# Altium schematic sheet 220VAC_to_24VDC_Circuit.SchDoc
size 254 x 330 mm; SheetNumber: 1; SheetTotal: 3
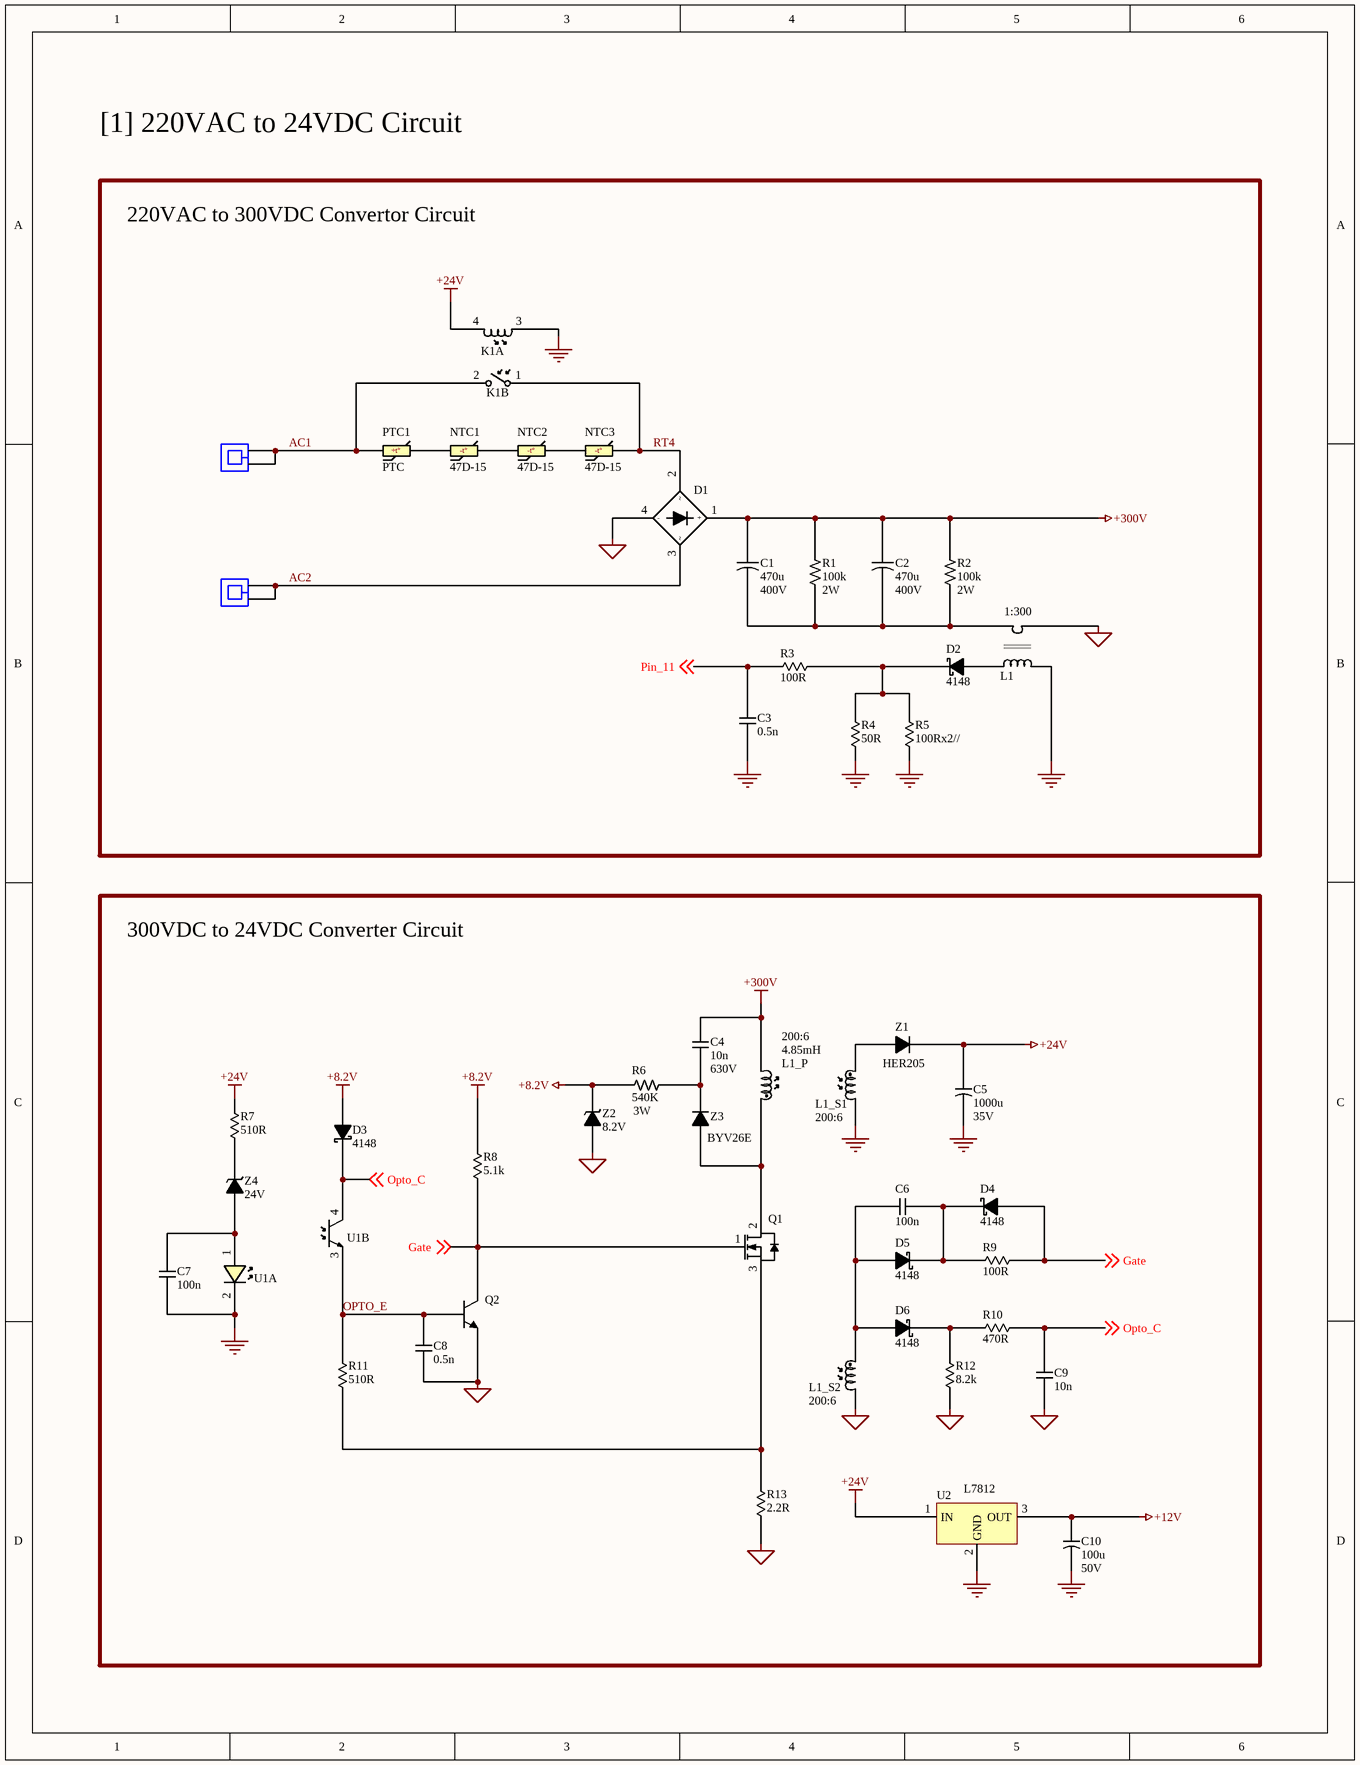
[diagram p0: 220VAC_to_24VDC_Circuit.SchDoc]

## Parts
C1  470u  Voltage: 400V  [Cap_THD_Polarized_10mm]
C2  470u  Voltage: 400V  [Cap_THD_Polarized_10mm]
C3  0.5n  [Cap_THD_Ceramic_5mm]
C4  10n  Voltage: 630V  [Cap_THD_Film_10mm]
C5  1000u  Voltage: 35V  [Cap_THD_Polarized_5mm]
C6  100n  [Cap_THD_Ceramic_5mm]
C7  100n  [Cap_THD_Ceramic_5mm]
C8  0.5n  [Cap_THD_Ceramic_5mm]
C9  10n  [Cap_THD_Ceramic_5mm]
C10  100u  Voltage: 50V  [Cap_THD_Polarized_5mm]
D1  D  [Bridge_THD]  (value not drawn)
D2  4148  [Diode_THD_7.1mm]
D3  4148  [Diode_THD_7.1mm]
D4  4148  [Diode_THD_7.1mm]
D5  4148  [Diode_THD_7.1mm]
D6  4148  [Diode_THD_7.1mm]
J1  63824-1  [CONN_QC_Faston_5mm]  (value not drawn)
J2  63824-1  [CONN_QC_Faston_5mm]  (value not drawn)
K1  K  [Relay_10mm]  (value not drawn)  (parts A,B of 2)
L1  L  [Current_Transformer]  (value not drawn)
L1_P  4.85mH  [Inductor_THD_5mm]
L1_S1  L  [Inductor_THD_5mm]  (value not drawn)
L1_S2  L  [Inductor_THD_5mm]  (value not drawn)
NTC1  47D-15  [NTC_THD_7.5mm]
NTC2  47D-15  [NTC_THD_7.5mm]
NTC3  47D-15  [NTC_THD_7.5mm]
PTC1  PTC  [PTC_THD_5mm]
Q1  K3878  [TO247]  (value not drawn)
Q2  SS8050  [TO92]  (value not drawn)
R1  100k  Power: 2W  [Res_THD_2W_17.6mm]
R2  100k  Power: 2W  [Res_THD_2W_17.6mm]
R3  100R  [Res_THD_0.25W_10mm]
R4  50R  [Res_THD_0.25W_10mm]
R5  100Rx2//  [Res_THD_0.25W_10mm]
R6  540K  Power: 3W  [Res_THD_2W_17.6mm]
R7  510R  [Res_THD_0.25W_10mm]
R8  5.1k  [Res_THD_0.25W_10mm]
R9  100R  [Res_THD_0.25W_10mm]
R10  470R  [Res_THD_0.25W_10mm]
R11  510R  [Res_THD_0.25W_10mm]
R12  8.2k  [Res_THD_0.25W_10mm]
R13  2.2R  [Res_THD_0.25W_10mm]
U1  U  [DIP4]  (value not drawn)  (parts A,B of 2)
U2  L7812  [TO220_3]
Z1  HER205  [Diode_THD_10.8mm]
Z2  8.2V  [Diode_THD_7.1mm]
Z3  BYV26E  [Diode_THD_10.8mm]
Z4  24V  [Diode_THD_7.1mm]

## Blocks framed on the sheet
220VAC to 300VDC Convertor Circuit: C1-C3 D1 D2 J1 J2 K1 L1 NTC1-NTC3 PTC1 R1-R5
300VDC to 24VDC Converter Circuit: C4-C10 D3-D6 L1_P L1_S1 L1_S2 Q1 Q2 R6-R13 U1 U2 Z1-Z4

## Nets
+8.2V: D3.2(A) R6.3 R8.4 Z2.1(K)
+12V: C10.1(+) U2.3(OUT)
+24V: C5.1(+) K1.4(Coil_2) R7.4 U2.1(IN) Z1.1(K)
+300V: C1.1(+) C2.1(+) C4.2 D1.1(+) L1_P.1 R1.4 R2.4
GND: C3.1 C5.2(-) C7.1 C10.2(-) K1.3(Coil_1) L1.4(S1) L1_S1.2 R4.3 R5.3 U1.2(K) U2.2(GND)
GND_1: C8.1 C9.1 D1.4(-) L1.1(P1) L1_S2.2 Q2.1(E) R12.3 R13.3 Z2.2(A)
AC1: J1.1 J1.2 K1.2(SW_2) PTC1.1
AC2: D1.3 J2.1 J2.2
Gate: D4.2(A) Q1.1(Gate) Q2.3(C) R8.3 R9.3 ; off-sheet Gate
Opto_C: C9.2 D3.1(K) R10.3 U1.4(E) ; off-sheet Opto_C
OPTO_E: C8.2 Q2.2(B) R11.4 U1.3(C)
Pin_11: C3.2 R3.4 ; off-sheet Pin_11
RT4: D1.2 K1.1(SW_1) NTC3.2
NetC1_2: C1.2(-) C2.2(-) L1.2(P2) R1.3 R2.3
NetC4_1: C4.1 R6.4 Z3.1(K)
NetC6_1: C6.1 D4.1(K) D5.1(K) R9.4
NetC6_2: C6.2 D5.2(A) D6.2(A) L1_S2.1
NetC7_2: C7.2 U1.1(A) Z4.2(A)
NetD2_1: D2.1(K) R3.3 R4.4 R5.4
NetD2_2: D2.2(A) L1.3(S2)
NetD6_1: D6.1(K) R10.4 R12.4
NetL1_P_2: L1_P.2 Q1.2(Drain) Z3.2(A)
NetL1_S1_1: L1_S1.1 Z1.2(A)
NetNTC1_1: NTC1.1 PTC1.2
NetNTC1_2: NTC1.2 NTC2.1
NetNTC2_2: NTC2.2 NTC3.1
NetQ1_3: Q1.3(Source) R11.3 R13.4
NetR7_3: R7.3 Z4.1(K)

## Notes on the sheet
- [1] 220VAC to 24VDC Circuit
- (near L1) 1:300
- 200:6
- (near L1_S1) 200:6
- (near L1_S2) 200:6
- (in symbol NTC) -t°
- (in symbol PTC) +t°

## Library data of the parts
C1 C2 = Cap_THD_Polarized_10mm: 10mm THD Polarized Capacitor; Package: Radial
C3 = Cap_THD_Ceramic_5mm: 5mm THD Ceramic Capacitor; Voltage: V
C4 = Cap_THD_Film_10mm
C5 C10 = Cap_THD_Polarized_5mm: 5mm THD Polarized Capacitor; Package: Radial
C6-C9 = Cap_THD_Ceramic_5mm: 5mm THD Ceramic Capacitor
D1 = Bridge_THD_1
D2-D6 = 1N4148: Rectifier Diode Small Signal Switching 100V 0.2A 4ns Automotive 2-Pin DO-35 Ammo; Manufacturer: NXP Semiconductors; Forward Current: 200mA; Capacitance: 4pF; Polarity: Standard; Max Forward Surge Current (Ifsm): 4A; Element Configuration: Single; Supplier 1: Arrow Electronics; Manufacturer Part Number: 1N4148; RoHS: Yes; Category: Uncategorized; Case/Package: SOD; Number of Pins: 2; Max Operating Temperature: 200°C; Packaging: Ammo Pack; Reverse Recovery Time: 4ns; Max Repetitive Reverse Voltage (Vrrm): 100V; Current Rating: 200mA; Voltage Rating (DC): 100V; Output Current: 200mA; Current: 4A; Voltage: 100V; RoHS Compliant: Yes; Lead Free: Lead Free; Reach SVHC Compliant: No; ComponentLink1URL: https://datasheet.ciiva.com/1179/1720485-1179297.pdf?src-supplier=Element14; ComponentLink1Description: https://datasheet.ciiva.com/1179/1720485-1179297.pdf?src-supplier=Element14; ComponentLink2URL: https://datasheet.ciiva.com/26921/getdatasheetpartid-764103-26921186.pdf?src-supplier=Verical; ComponentLink2Description: https://datasheet.ciiva.com/26921/getdatasheetpartid-764103-26921186.pdf?src-supplier=Verical; Supplier Part Number 1: 1N4148
J1 J2 = CONN_QC_Faston: Quick Connect Terminal; Manufacturer: TE Connectivity; Body Material: Brass; Plating: Tin; Gender: Male; Insulation: Non-Insulated; Tab Width: 6.35mm; Tab Thickness: 0.83mm; Mating Tab Width: 0.25inch; Hole Diameter: 0.055inch; PCB Thickness: 0.062inch; Supplier 1: Arrow Electronics; Manufacturer Part Number: 63824-1; RoHS: Yes; Category: Terminals; Stock 1: 23665; Pricing 1: 1=0.0808, 10=0.0729, 25=0.053, 100=0.0524, 250=0.0519, 500=0.0514, 1000=0.0509, 3000=0.0504, 6000=0.0448, 15000=0.0426 (USD); Mount: Through Hole; Contact Material: Brass; Contact Plating: Tin; Color: Silver; Material: Brass; Body Plating: Tin; Terminal Material: Brass; Min Operating Temperature: -30°C; Max Operating Temperature: 110°C; Package Quantity: 10000; Packaging: Tape and Reel; Termination: Tab; Orientation: Straight; Series: Faston; Length: 13.63mm; Height: 14.02mm; Depth: 7.92mm; Size: 0.032inch; Radiation Hardening: No; Lead Free: Lead Free; ELV: Compliant; RoHS Compliant: Yes; Reach SVHC Compliant: Unknown; ComponentLink1URL: https://datasheet.ciiva.com/11721/0900766b80ddd72b-11721738.pdf?src-supplier=Rs; ComponentLink1Description: https://datasheet.ciiva.com/11721/0900766b80ddd72b-11721738.pdf?src-supplier=Rs; ComponentLink2URL: https://datasheet.ciiva.com/839/eng-cd-63824-r-basefilename-839115.pdf?src-supplier=Digi-Key; ComponentLink2Description: https://datasheet.ciiva.com/839/eng-cd-63824-r-basefilename-839115.pdf?src-supplier=Digi-Key; ComponentLink3URL: https://datasheet.ciiva.com/46393/1650963-46393511.pdf?src-supplier=Element14; ComponentLink3Description: https://datasheet.ciiva.com/46393/1650963-46393511.pdf?src-supplier=Element14; ComponentLink4URL: https://datasheet.ciiva.com/7873/1650963-7873563.pdf?src-supplier=Element14; ComponentLink4Description: https://datasheet.ciiva.com/7873/1650963-7873563.pdf?src-supplier=Element14; ComponentLink5URL: https://datasheet.ciiva.com/3144/eng-cs-82004-faston-pcb-tabs-receptacles-0914-3144076.pdf?src-supplier=Avnet; ComponentLink5Description: https://datasheet.ciiva.com/3144/eng-cs-82004-faston-pcb-tabs-receptacles-0914-3144076.pdf?src-supplier=Avnet; Supplier Part Number 1: 63824-1
K1 = Relay
L1 = Transformer Current
L1_P = Inductor TX: TX Coupled Inductor
L1_S1 L1_S2 = Inductor RX: RX Coupled Inductor
NTC1-NTC3 = NTC
Q1 = 2SK3878: Trans MOSFET N-CH Si 900V 9A 3Pin TO-3PN; Fall Time: 20ns; Gate to Source Voltage (Vgs): 30V; Input Capacitance: 2.2nF; Continuous Drain Current (Id): 9A; Drain to Source Voltage (Vdss): 900V; Package: TO-3PN
Q2 = SS8050: Bipolar Transistor BJT NPN Epitaxial Silicon 25V 1500mA 100MHz 1W TO-92-3; Manufacturer: ON Semiconductor / Fairchild; Manufacturer Part Number: SS8050DTA; Max Collector Current: 1.5A; Collector-emitter Voltage-Max: 500mV; hFE Min: 85; Collector Base Voltage (VCBO): 40V; Emitter Base Voltage (VEBO): 6V; Supplier 1: Future Electronics; RoHS: Yes; Category: BJTs; Stock 1: 10000; Pricing 1: 2000=0.0536, 6000=0.0516, 20000=0.0496, 40000=0.0484, 80000=0.0463 (USD); Mount: Through Hole; Case/Package: TO-92-3; Number of Pins: 3; Weight: 0.24g; Min Operating Temperature: -65°C; Max Operating Temperature: 150°C; Packaging: Ammo Pack; Series: -; Package Quantity: 2000; Max Power Dissipation: 1W; Transition Frequency: 100MHz; Collector Emitter Breakdown Voltage: 25V; Polarity: NPN; Collector Emitter Saturation Voltage: 500mV; Gain Bandwidth Product: 100MHz; Voltage Rating (DC): 25V; Collector Emitter Voltage (VCEO): 25V; Max Breakdown Voltage: 25V; Current Rating: 1.5A; Length: 4.58mm; Width: 3.86mm; Height: 4.58mm; Radiation Hardening: No; RoHS Compliant: Yes; Lead Free: Lead Free; Reach SVHC Compliant: No; ComponentLink1URL: https://datasheet.ciiva.com/4721/ss8050-117753-4721333.pdf?src-supplier=Mouser; ComponentLink1Description: https://datasheet.ciiva.com/4721/ss8050-117753-4721333.pdf?src-supplier=Mouser; ComponentLink2URL: https://datasheet.ciiva.com/11207/ss8050-11207512.pdf?src-supplier=Avnet; ComponentLink2Description: https://datasheet.ciiva.com/11207/ss8050-11207512.pdf?src-supplier=Avnet; ComponentLink3URL: https://datasheet.ciiva.com/18648/ss8050-18648133.pdf?src-supplier=Digi-Key; ComponentLink3Description: https://datasheet.ciiva.com/18648/ss8050-18648133.pdf?src-supplier=Digi-Key; ComponentLink4URL: https://datasheet.ciiva.com/17447/ss8050-17447834.pdf?src-supplier=Future+Electronics; ComponentLink4Description: https://datasheet.ciiva.com/17447/ss8050-17447834.pdf?src-supplier=Future+Electronics; ComponentLink5URL: https://datasheet.ciiva.com/46415/1868828-46415608.pdf?src-supplier=Element14; ComponentLink5Description: https://datasheet.ciiva.com/46415/1868828-46415608.pdf?src-supplier=Element14; Supplier Part Number 1: 7178421
R1 R2 R6 = Res_THD_2W: 500mW THD Resistor
R3-R5 = Res_THD_0.25W: 250mW THD Resistor; Power Rating: 0.25W
R7-R13 = Res_THD_0.25W: 250mW THD Resistor; Power Rating: 250mW; Package: Axial
U1 = PC817
Z1 Z3 = Diode_THD_FRD: 10mm Axial Fast Recovery Diode
Z2 Z4 = Diode_THD_Zener: 10mm Axial Zener Diode